# EAGLE schematic Encoder (EAGLE 8.2.2)
CNAME: Simulacare; CREVISION: 1.0.0; DESIGNER: Rinaldo; UNTITLED: Sensor Encoder
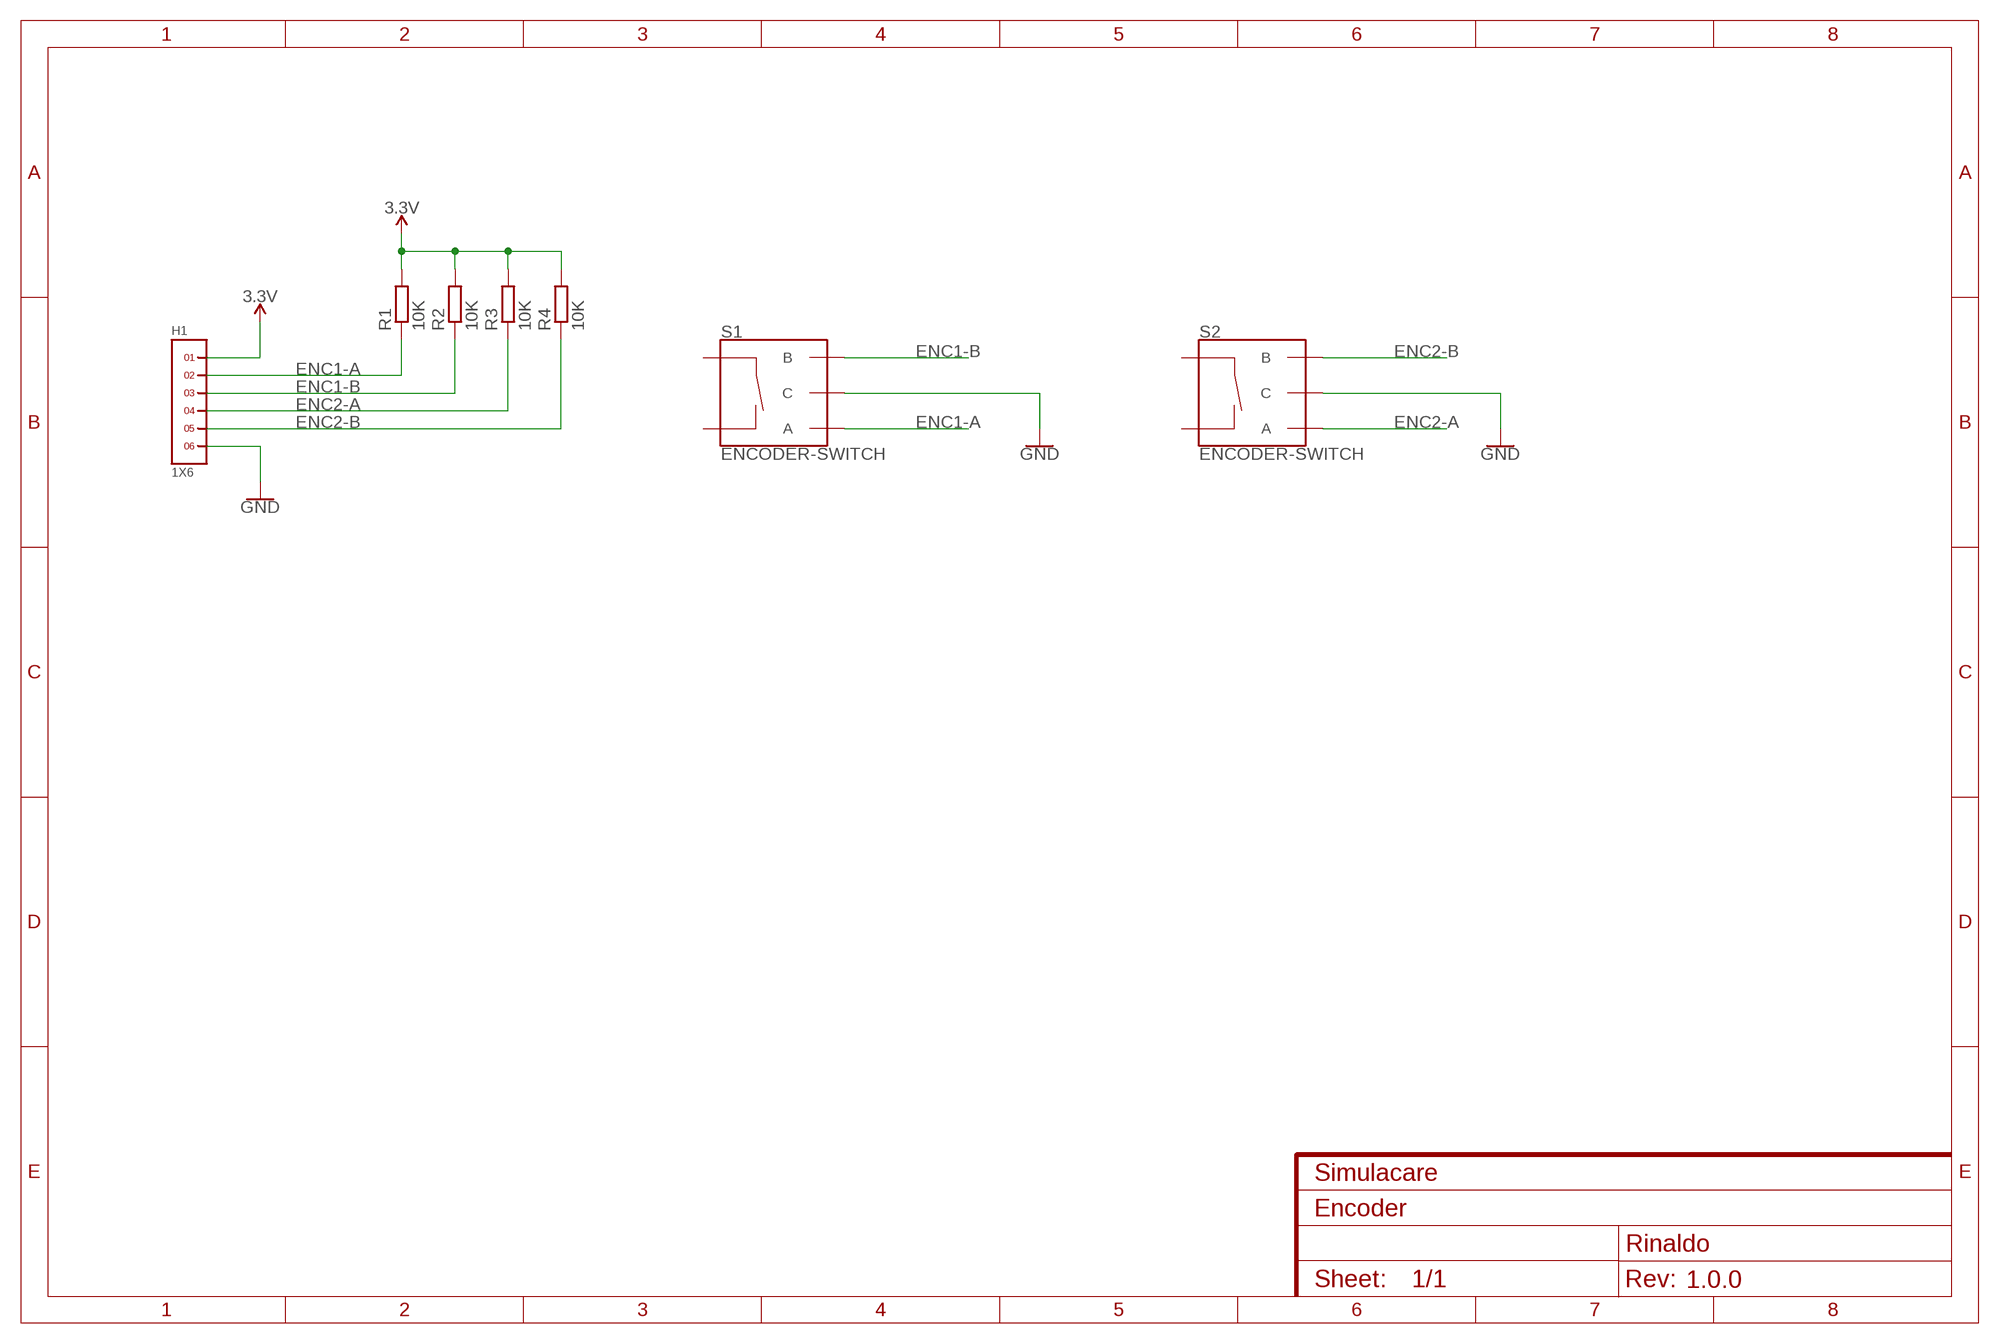
[diagram p0: schematic, sheet 1]

## Parts
H1  1X6  [1X6]
R1  10K  R-EU_R0603  [R0603]
R2  10K  R-EU_R0603  [R0603]
R3  10K  R-EU_R0603  [R0603]
R4  10K  R-EU_R0603  [R0603]
S1  ENCODER-SWITCH  [ROTARY_ENC_PLAIN]
S2  ENCODER-SWITCH  [ROTARY_ENC_PLAIN]

## Nets
3.3V: H1.1 R1.2 R2.2 R3.2 R4.2
ENC1-A: H1.2 R1.1 S1.A
ENC1-B: H1.3 R2.1 S1.B
ENC2-A: H1.4 R3.1 S2.A
ENC2-B: H1.5 R4.1 S2.B
GND: H1.6 S1.C S2.C
Unconnected: S1.SW+ S1.SW- S2.SW+ S2.SW-

## Library data of the parts
H1 = header:1X6
R1-R4 = resistor:R-EU_: RESISTOR, European symbol
S1 S2 = SparkFun-Switches:ENCODER-SWITCH: Rotary Encoder w/ Select Switch Encoders rotate similarly to potentiometers, but they’re different from potentiometers in that an encoder has full rotation without limits. They output gray code so that you can tell how much and in which direction the encoder has been turned. This encoder includes a push-down select switch built into the shaft. SparkFun Products Rotary Encoder <https://www.sparkfun.com/products/9117> (COM-09117); SF_SKU: COM-09117